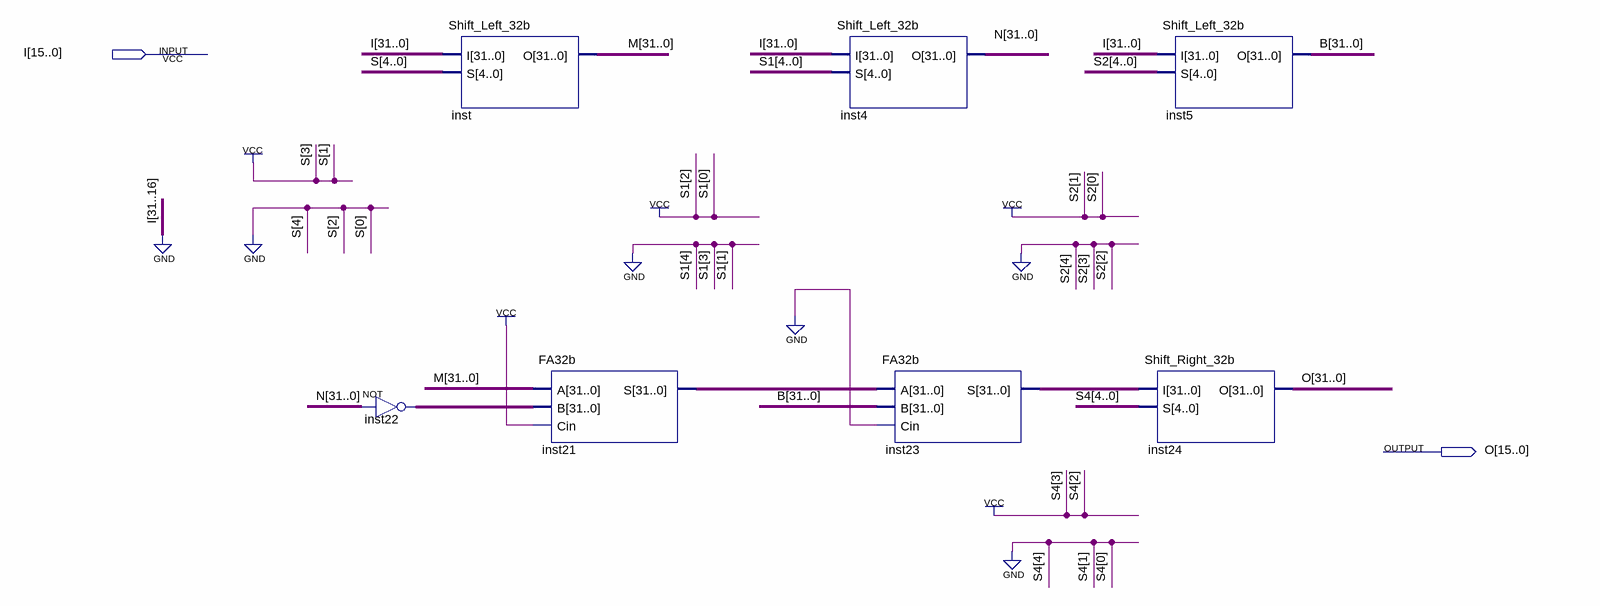
[diagram p0: schematic sheet]
// Quartus schematic Output_Processor.bdf as structural Verilog: 7 symbols, 2 pins
module Output_Processor (
  input  [15:0] I,
  output [31:0] O
);

  wire [31:0] B, inst21_s, inst22_out, inst23_s, M, N;

  assign inst22_out = ~N;  // NOT inst22, 32 bits wide
  Shift_Left_32b inst (.I({{16{1'b0}}, I}), .S(5'b01010), .O(M));
  FA32b inst21 (.A(M), .B(inst22_out), .Cin(1'b1), .S(inst21_s));
  Shift_Left_32b inst4 (.I({{16{1'b0}}, I}), .S(5'b00101), .O(N));
  FA32b inst23 (.A(inst21_s), .B(B), .Cin(1'b0), .S(inst23_s));
  Shift_Left_32b inst5 (.I({{16{1'b0}}, I}), .S(5'b00011), .O(B));
  Shift_Right_32b inst24 (.I(inst23_s), .S(5'b01100), .O(O));
endmodule
